# Altium schematic sheet HDMI_To_MIPI_PHY.SchDoc
size A4
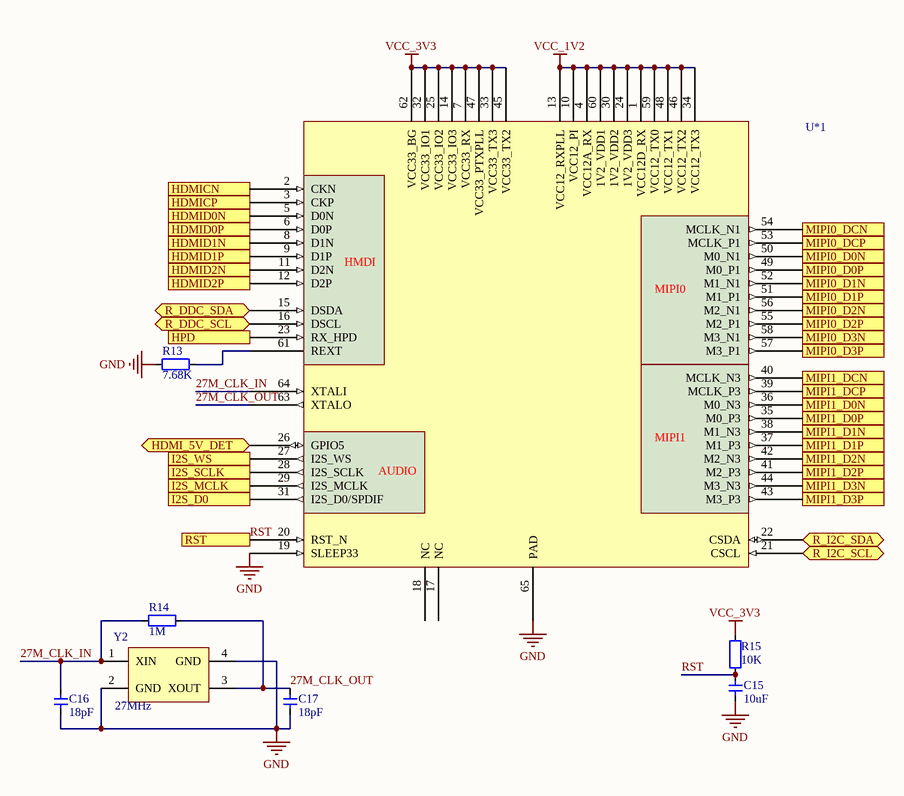
[diagram p0: HDMI_To_MIPI_PHY.SchDoc]

## Parts
C15  10uF  [CAP_0402]
C16  18pF  [CAP_0402]
C17  18pF  [CAP_0402]
R13  7.68K  [RES_0402]
R14  1M  [RES_0402]
R15  10K  [RES_0402]
U*1  LT6911C  [QFN-64-0.4mm]  (value not drawn)
Y2  27MHz  [晶振2520]

## Ports
HDMI_5V_DET (bidir), HDMICN (in), HDMICP (in), HDMID0N (in), HDMID0P (in), HDMID1N (in), HDMID1P (in), HDMID2N (in), HDMID2P (in), HPD (out), I2S_D0 (out), I2S_MCLK (out), I2S_SCLK (out), I2S_WS (out), MIPI0_D0N (out), MIPI0_D0P (out), MIPI0_D1N (out), MIPI0_D1P (out), MIPI0_D2N (out), MIPI0_D2P (out), MIPI0_D3N (out), MIPI0_D3P (out), MIPI0_DCN (out), MIPI0_DCP (out), MIPI1_D0N (out), MIPI1_D0P (out), MIPI1_D1N (out), MIPI1_D1P (out), MIPI1_D2N (out), MIPI1_D2P (out), MIPI1_D3N (out), MIPI1_D3P (out), MIPI1_DCN (out), MIPI1_DCP (out), R_DDC_SCL (bidir), R_DDC_SDA (bidir), R_I2C_SCL (bidir), R_I2C_SDA (bidir), RST (in)

## Nets
GND: C15.1 C16.1 C17.1 R13.1 U*1.19(SLEEP33) U*1.65(PAD) Y2.2(GND) Y2.4(GND)
VCC_1V2: U*1.1(VCC12D_RX) U*1.4(VCC12A_RX) U*1.10(VCC12_PI) U*1.13(VCC12_RXPLL) U*1.24(1V2_VDD3) U*1.30(1V2_VDD2) U*1.34(VCC12_TX3) U*1.46(VCC12_TX2) U*1.48(VCC12_TX1) U*1.59(VCC12_TX0) U*1.60(1V2_VDD1)
VCC_3V3: R15.2 U*1.7(VCC33_RX) U*1.14(VCC33_IO3) U*1.25(VCC33_IO2) U*1.32(VCC33_IO1) U*1.33(VCC33_TX3) U*1.45(VCC33_TX2) U*1.47(VCC33_PTXPLL) U*1.62(VCC33_BG)
27M_CLK_IN: C16.2 R14.1 U*1.64(XTALI) Y2.1(XIN)
27M_CLK_OUT: C17.2 R14.2 U*1.63(XTALO) Y2.3(XOUT)
HDMI_5V_DET: U*1.26(GPIO5) ; port HDMI_5V_DET
HDMICN: U*1.2(CKN) ; port HDMICN
HDMICP: U*1.3(CKP) ; port HDMICP
HDMID0N: U*1.5(D0N) ; port HDMID0N
HDMID0P: U*1.6(D0P) ; port HDMID0P
HDMID1N: U*1.8(D1N) ; port HDMID1N
HDMID1P: U*1.9(D1P) ; port HDMID1P
HDMID2N: U*1.11(D2N) ; port HDMID2N
HDMID2P: U*1.12(D2P) ; port HDMID2P
HPD: U*1.23(RX_HPD) ; port HPD
I2S_D0: U*1.31(I2S_D0/SPDIF) ; port I2S_D0
I2S_MCLK: U*1.29(I2S_MCLK) ; port I2S_MCLK
I2S_SCLK: U*1.28(I2S_SCLK) ; port I2S_SCLK
I2S_WS: U*1.27(I2S_WS) ; port I2S_WS
MIPI0_D0N: U*1.50(M0_N1) ; port MIPI0_D0N
MIPI0_D0P: U*1.49(M0_P1) ; port MIPI0_D0P
MIPI0_D1N: U*1.52(M1_N1) ; port MIPI0_D1N
MIPI0_D1P: U*1.51(M1_P1) ; port MIPI0_D1P
MIPI0_D2N: U*1.56(M2_N1) ; port MIPI0_D2N
MIPI0_D2P: U*1.55(M2_P1) ; port MIPI0_D2P
MIPI0_D3N: U*1.58(M3_N1) ; port MIPI0_D3N
MIPI0_D3P: U*1.57(M3_P1) ; port MIPI0_D3P
MIPI0_DCN: U*1.54(MCLK_N1) ; port MIPI0_DCN
MIPI0_DCP: U*1.53(MCLK_P1) ; port MIPI0_DCP
MIPI1_D0N: U*1.36(M0_N3) ; port MIPI1_D0N
MIPI1_D0P: U*1.35(M0_P3) ; port MIPI1_D0P
MIPI1_D1N: U*1.38(M1_N3) ; port MIPI1_D1N
MIPI1_D1P: U*1.37(M1_P3) ; port MIPI1_D1P
MIPI1_D2N: U*1.42(M2_N3) ; port MIPI1_D2N
MIPI1_D2P: U*1.41(M2_P3) ; port MIPI1_D2P
MIPI1_D3N: U*1.44(M3_N3) ; port MIPI1_D3N
MIPI1_D3P: U*1.43(M3_P3) ; port MIPI1_D3P
MIPI1_DCN: U*1.40(MCLK_N3) ; port MIPI1_DCN
MIPI1_DCP: U*1.39(MCLK_P3) ; port MIPI1_DCP
R_DDC_SCL: U*1.16(DSCL) ; port R_DDC_SCL
R_DDC_SDA: U*1.15(DSDA) ; port R_DDC_SDA
R_I2C_SCL: U*1.21(CSCL) ; port R_I2C_SCL
R_I2C_SDA: U*1.22(CSDA) ; port R_I2C_SDA
RST: C15.2 R15.1 U*1.20(RST_N) ; port RST
NetR13_2: R13.2 U*1.61(REXT)

Not connected (* = marked no-connect by the designer): U*1 17(NC) 18(NC)

## Notes on the sheet
- (in symbol LT6911C) HMDI; MIPI0; MIPI1; AUDIO

## Library data of the parts
C15-C17 = 电容-0402: Capacitor; Value: 0.1u
R13-R15 = 电阻-0402: Resistor; Value: 22R
U*1 = LT6911C: HDMI to MIPI PHY
Y2 = 晶振-4Pin-无源: 2520无源; MF: ECS International; MP: ECS-3225S30-240-EN-TR; Package: SMD-6 ECS International; Price: 0.75 USD; Availability: Unavailable; Value: *